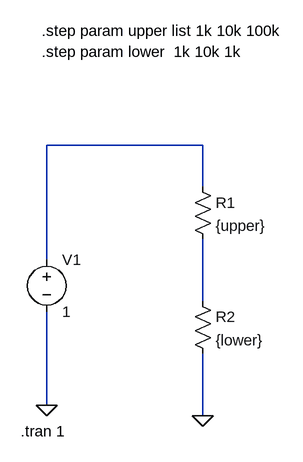
[diagram p0: schematic step.asc]
step.asc, the LTspice schematic file:
Version 4.1
SHEET 1 880 680
WIRE 288 -16 48 -16
WIRE 288 48 288 -16
WIRE 48 160 48 -16
WIRE 288 224 288 128
WIRE 48 384 48 240
WIRE 288 400 288 304
FLAG 288 400 0
FLAG 48 384 0
SYMBOL voltage 48 144 R0
SYMATTR InstName V1
SYMATTR Value 1
SYMBOL res 272 32 R0
SYMATTR InstName R1
SYMATTR Value {upper}
SYMBOL res 272 208 R0
SYMATTR InstName R2
SYMATTR Value {lower}
TEXT 40 -192 Left 2 !.step param upper list 1k 10k 100k
TEXT 40 -160 Left 2 !.step param lower  1k 10k 1k
TEXT 8 424 Left 2 !.tran 1

The netlist it stands for:
* step.asc
V1 N001 0 1
R1 N001 N002 {upper}
R2 N002 0 {lower}
.step param upper list 1k 10k 100k
.step param lower  1k 10k 1k
.tran 1
.backanno
.end